# EAGLE design Amplificador_Push_Pull_AB (EAGLE 7.6.0)
CNAME: Amplificador Push-Pull; CREVISION: 1.0; DESIGNER: Pedro Nori
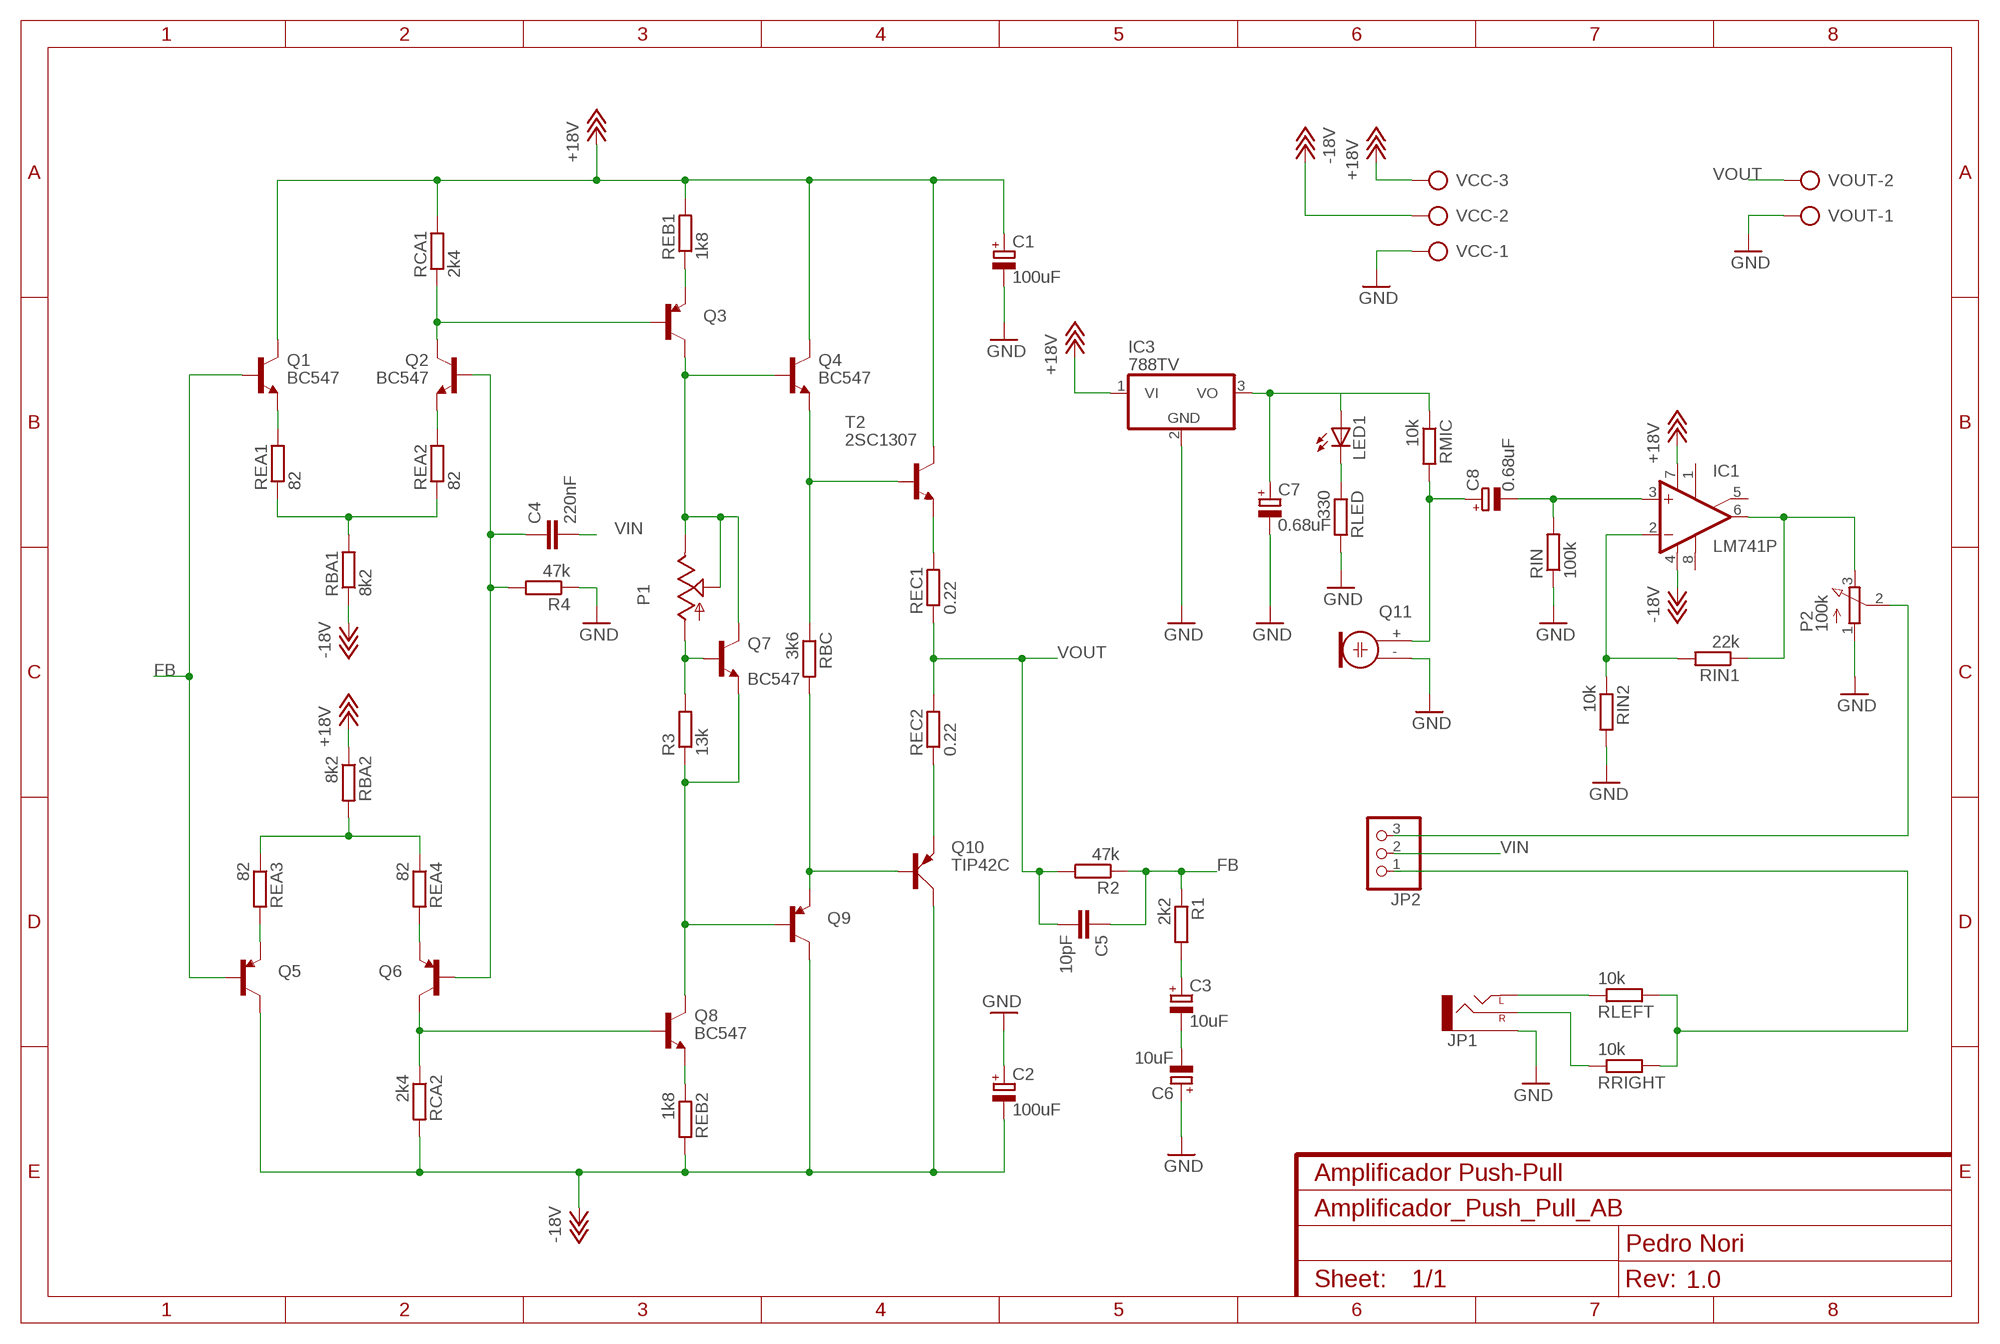
[diagram p0: schematic, sheet 1]
AUI_MAUE (FRAME-A4L): TESTE1: valordoteste1

## Parts
C1  100uF  CPOL-EUE2.5-6  [E2,5-6]
C2  100uF  CPOL-EUE2.5-6  [E2,5-6]
C3  10uF  CPOL-EUE2.5-5  [E2,5-5]
C4  220nF  C-EU025-025X050  [C025-025X050]
C5  10pF  C-EU025-025X050  [C025-025X050]
C6  10uF  CPOL-EUE2.5-5  [E2,5-5]
C7  0.68uF  CPOL-EUE2.5-5  [E2,5-5]
C8  0.68uF  CPOL-EUE2.5-5  [E2,5-5]
IC1  LM741P  [DIL08]
IC3  788TV  [TO220V]
JP1  AUDIO-JACKPTH  [AUDIO-JACK]
JP2  PINHD-1X3  [1X03]
LED1  LED5MM  [LED5MM]
P1  TRIM_US-S64W  [S64W]
P2  100k  3RP/1610N  [3RP/1610N]
Q1  BC547  [TO92]
Q2  BC547  [TO92]
Q3  TRANSISTOR_PNPTO92  [TO-92]
Q4  BC547  [TO92]
Q5  TRANSISTOR_PNPTO92  [TO-92]
Q6  TRANSISTOR_PNPTO92  [TO-92]
Q7  BC547  [TO92]
Q8  BC547  [TO92]
Q9  TRANSISTOR_PNPTO92  [TO-92]
Q10  TIP42C  [TO220AV]
Q11  ELECTRET  [9.7ELECTRET]
R1  2k2  R-EU_0207/10  [0207/10]
R2  47k  R-EU_0207/10  [0207/10]
R3  13k  R-EU_0207/10  [0207/10]
R4  47k  R-EU_0207/10  [0207/10]
RBA1  8k2  R-EU_0207/10  [0207/10]
RBA2  8k2  R-EU_0207/10  [0207/10]
RBC  3k6  R-EU_0207/10  [0207/10]
RCA1  2k4  R-EU_0207/10  [0207/10]
RCA2  2k4  R-EU_0207/10  [0207/10]
REA1  82  R-EU_0207/10  [0207/10]
REA2  82  R-EU_0207/10  [0207/10]
REA3  82  R-EU_0207/10  [0207/10]
REA4  82  R-EU_0207/10  [0207/10]
REB1  1k8  R-EU_0207/10  [0207/10]
REB2  1k8  R-EU_0207/10  [0207/10]
REC1  0.22  R-EU_0617/22  [0617/22]
REC2  0.22  R-EU_0617/22  [0617/22]
RIN  100k  R-EU_0207/7  [0207/7]
RIN1  22k  R-EU_0207/7  [0207/7]
RIN2  10k  R-EU_0207/10  [0207/10]
RLED  330  R-EU_0207/7  [0207/7]
RLEFT  10k  R-EU_0207/7  [0207/7]
RMIC  10k  R-EU_0207/7  [0207/7]
RRIGHT  10k  R-EU_0207/7  [0207/7]
T2  2SC1307  [TO220AV]
VCC  AK500/3-H  [AK500/3-H]
VOUT  AK500/2-H  [AK500/2-H]

## Nets
+5V: C7.+ IC3.3(VO) LED1.A RMIC.1
+18V: C1.+ IC1.7(V+) IC3.1(VI) Q1.3(C) Q4.3(C) RBA2.1 RCA1.2 REB1.2 T2.2(C) VCC.3
-18V: C2.- IC1.4(V-) Q5.1(C) Q9.1(C) Q10.C RBA1.1 RCA2.2 REB2.2 VCC.2
FB: C5.1 Q1.2(B) Q5.2(B) R1.1 R2.1
GND: C1.- C2.+ C6.+ C7.- IC3.2(GND) JP1.SLEEVE P2.1(A) Q11.- R4.1 RIN2.2 RIN.1 RLED.2 VCC.1 VOUT.1
HEHEAH: C4.1 Q2.2(B) Q6.2(B) R4.2
N$1: Q1.1(E) REA1.2
N$2: RBA1.2 REA1.1 REA2.1
N$3: RBA2.2 REA3.1 REA4.1
N$4: Q2.1(E) REA2.2
N$5: Q2.3(C) Q3.2(B) RCA1.1
N$6: Q6.3(E) REA4.2
N$7: Q5.3(E) REA3.2
N$8: Q6.1(C) Q8.2(B) RCA2.1
N$9: C8.+ Q11.+ RMIC.2
N$10: Q3.3(E) REB1.1
N$11: P1.E P1.S Q3.1(C) Q4.2(B) Q7.3(C)
N$12: JP1.RING(RIGHT) RRIGHT.1
N$13: Q4.1(E) RBC.1 T2.1(B)
N$14: JP1.TIP(LEFT) RLEFT.1
N$15: Q7.1(E) Q8.3(C) Q9.2(B) R3.1
N$16: Q8.1(E) REB2.1
N$17: Q9.3(E) Q10.B RBC.2
N$18: LED1.K(C) RLED.1
N$19: REC1.2 T2.3(E)
N$20: JP2.1 RLEFT.2 RRIGHT.2
N$21: Q10.E REC2.1
N$22: C3.- C6.-
N$23: C3.+ R1.2
N$25: C8.- IC1.3(+IN) RIN.2
N$26: IC1.2(-IN) RIN1.2 RIN2.1
N$27: IC1.6(OUT) P2.3(E) RIN1.1
N$30: JP2.3 P2.2(S)
P1: P1.A Q7.2(B) R3.2
VIN: C4.2 JP2.2
VOUT: C5.2 R2.2 REC1.1 REC2.2 VOUT.2
Unconnected: IC1.1(ON1) IC1.5(ON2) IC1.8(OPT)

## Library data of the parts
C1-C3 C6-C8 = rcl:CPOL-EU: POLARIZED CAPACITOR, European symbol
C4 C5 = rcl:C-EU: CAPACITOR, European symbol
IC1 = linear:*741: OP AMP
IC3 = linear:78*: Positive VOLTAGE REGULATOR Source: http://cache.national.com/ds/LM/LM78L05.pdf http://www.fairchildsemi.com/ds/LM/LM7805.pdf
JP1 = SparkFun-Connectors:AUDIO-JACK: 3.5mm Audio Jack Simple 3.5mm common PCB mount audio jack. SKU: PRT-08032
JP2 = pinhead:PINHD-1X3: PIN HEADER
LED1 = adafruit:LED: LED OSRAM: - CHIPLED LG R971, LG N971, LY N971, LG Q971, LY Q971, LO R971, LY R971 LH N974, LH R974 LS Q976, LO Q976, LY Q976 LO Q996 - Hyper CHIPLED LW Q18S LB Q993, LB Q99A, LB R99A - SideLED LS A670, LO A670, LY A670, LG A670, LP A670 LB A673, LV A673, LT A673, LW A673 LH A674 LY A675 LS A676, LA A676, LO A676, LY A676, LW A676 LS A679, LY A679, LG A679 - Hyper Micro SIDELED® LS Y876, LA Y876, LO Y876, LY Y876 LT Y87S - SmartLED LW L88C, LW L88S LB L89C, LB L89S, LG L890 LS L89K, LO L89K, LY L89K LS L896, LA L896, LO L896, LY L896 - TOPLED LS T670, LO T670, LY T670, LG T670, LP T670 LSG T670, LSP T670, LSY T670, LOP T670, LYG T670 LG T671, LOG T671, LSG T671 LB T673, LV T673, LT T673, LW T673 LH T674 LS T676, LA T676, LO T676, LY T676, LB T676, LH T676, LSB T676, LW T676 LB T67C, LV T67C, LT T67C, LS T67K, LO T67K, LY T67K, LW E67C LS E67B, LA E67B, LO E67B, LY E67B, LB E67C, LV E67C, LT E67C LW T67C LS T679, LY T679, LG T679 LS T770, LO T770, LY T770, LG T770, LP T770 LB T773, LV T773, LT T773, LW T773 LH T774 LS E675, LA E675, LY E675, LS T675 LS T776, LA T776, LO T776, LY T776, LB T776 LHGB T686 LT T68C, LB T68C - Hyper Mini TOPLED® LB M676 - Mini TOPLED Santana® LG M470 LS M47K, LO M47K, LY M47K Source: http://www.osram.convergy.de/
P1 = pot:TRIM_US-: POTENTIOMETER
P2 = pot:3RP/1610N: 16mm Potentiometer one level Source: http://www.alphapotentiometers.net/html/16mm_pot_2.html
Q1 Q2 Q4 Q7 Q8 = transistor:BC547: NPN TRANSISTOR
Q3 Q5 Q6 Q9 = SparkFun-DiscreteSemi:TRANSISTOR_PNP: Generic PNP BJT Double check pinouts against datasheets- not all devices are the same! MMBT3906 - 40V 200mA SOT-23 (TRANS-08052) MMBT4403 - 40V 600mA SOT-23 (TRANS-09245)
Q10 = transistor-power:TIP42C: PNP TRANSISTOR
Q11 = adafruit:ELECTRET: Electret microphone Thru hole 2.54mm spacing with 9.7mm diameter
R1-R4 RBA1 RBA2 RBC RCA1 RCA2 REA1-REA4 REB1 REB2 REC1 REC2 RIN RIN1 RIN2 RLED RLEFT RMIC RRIGHT = rcl:R-EU_: RESISTOR, European symbol
T2 = transistor-neu-to92:2SC1307: NPN Transistor Silicon Epitaxial, High Frequency Power Amplifier Source: 2SC1307.pdf
VCC = con-ptr500:AK500/3-H: CONNECTOR Aug. 2004 / PTR Meßtechnik: Die Bezeichnung der Serie AK505 wurde geändert. Es handelt sich hierbei um AK500 in horizontaler Ausführung.; OC_FARNELL: unknown; OC_NEWARK: unknown
VOUT = con-ptr500:AK500/2-H: CONNECTOR Aug. 2004 / PTR Meßtechnik: Die Bezeichnung der Serie AK505 wurde geändert. Es handelt sich hierbei um AK500 in horizontaler Ausführung.; OC_FARNELL: unknown; OC_NEWARK: unknown

## Board
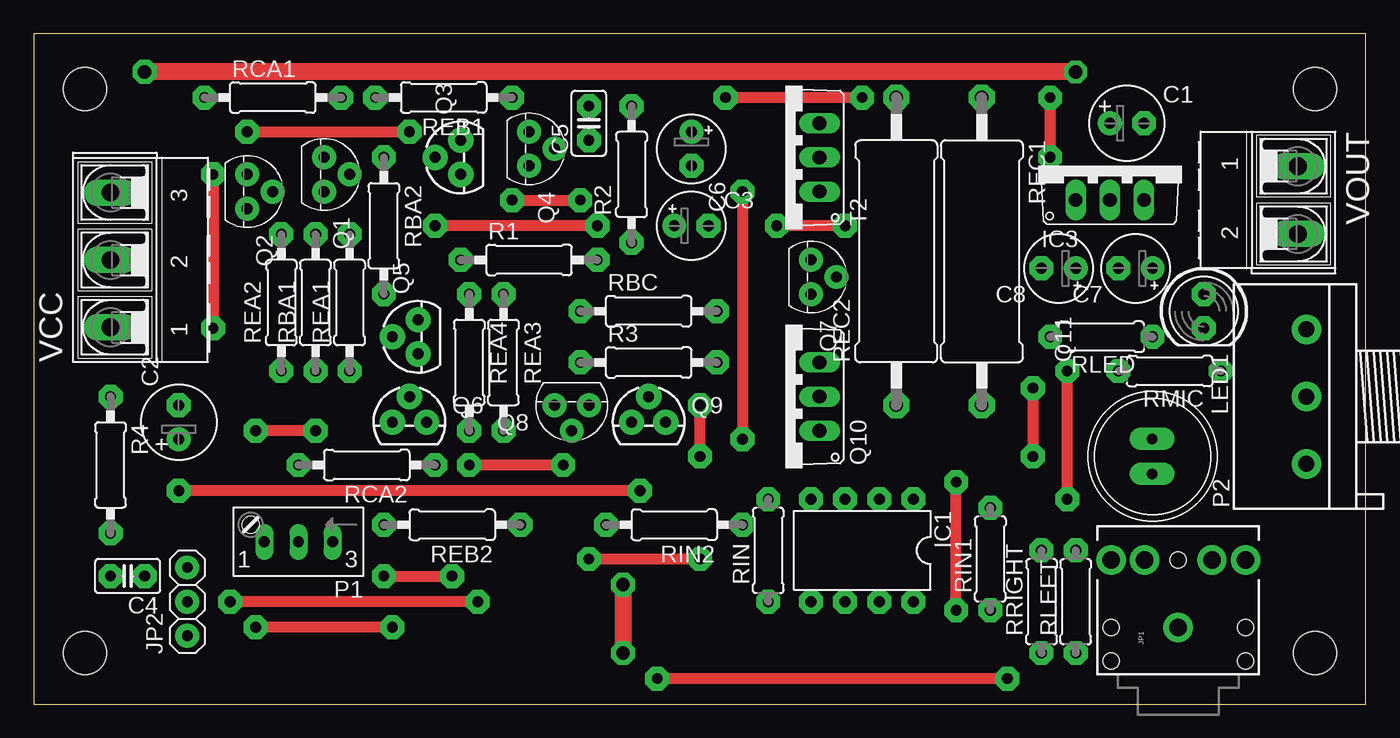
[diagram p1: board, top side]
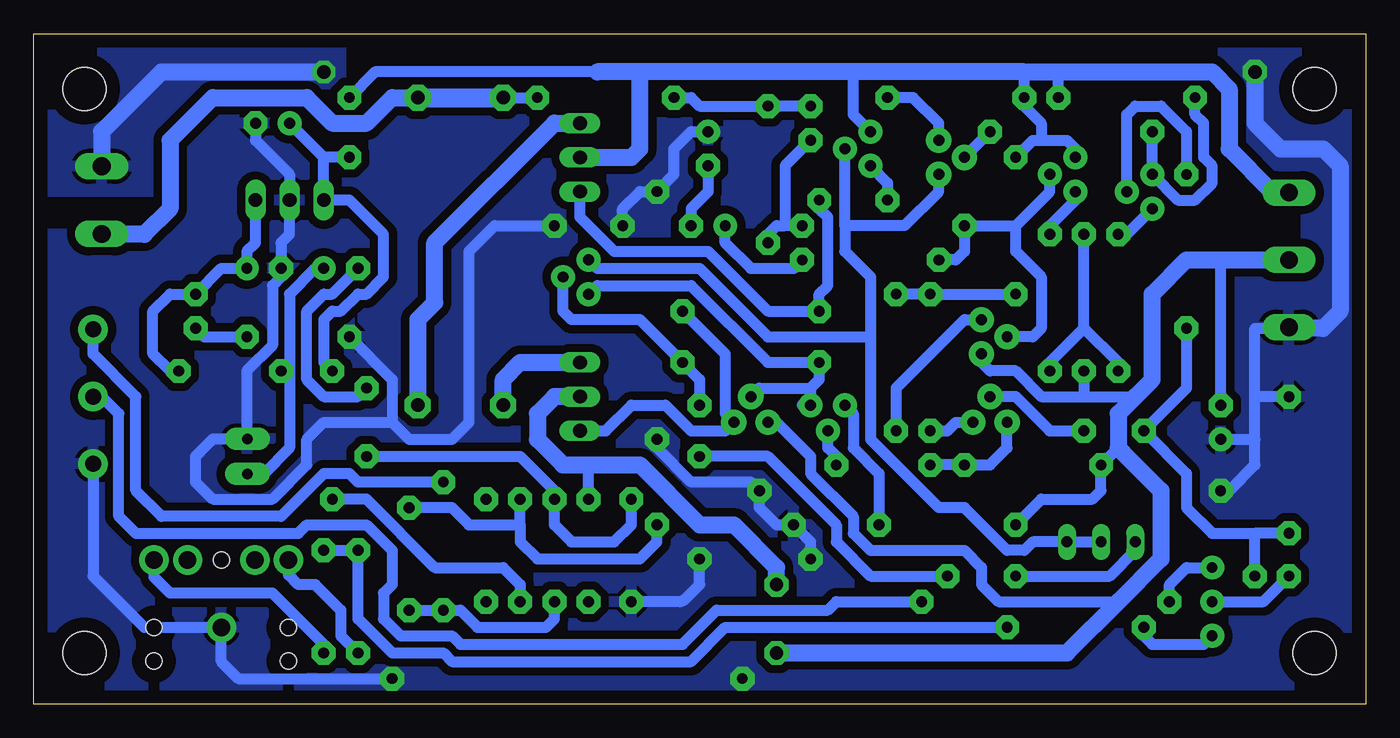
[diagram p2: board, bottom side, seen from below]

Size 99.04 x 49.84 mm. Coordinates in mm from the lower left corner, seen from the top.
Outline: 0,0 99.04,0 99.04,49.84 0,49.84 0,0
Copper layers (1*16): Top 0.035mm / dielectric 1.5mm / Bottom 0.035mm
Design rules "default *": minimum track width 10mil, minimum drill 24mil, track to track 8mil, track to pad 8mil, pad to pad 8mil, via to via 8mil, smd to smd 8mil, copper to edge 40mil, drill to drill 8mil, minimum pad ring 10mil, minimum via ring 8mil, stop-mask expansion 4mil, vias tented up to drill 0mil, thermal gap 12mil
Holes 3.2 mm at 3.81,3.81 3.81,45.72 95.25,45.72 95.25,3.81

### Footprints (pad centres in the part's own frame; a part is rotated, then mirrored left to right if it is on the bottom)
E2,5-6 = drill 0.813 pad 1.778: + -1.27,0 | drill 0.813 pad 1.778 octagon: - 1.27,0
E2,5-5 = drill 0.813 pad 1.778: + -1.27,0 | drill 0.813 pad 1.778 octagon: - 1.27,0
C025-025X050 = drill 0.8 pad 1.778 octagon: 1 -1.27,0; 2 1.27,0
DIL08 = drill 0.813 pad 1.778 octagon: 1 -3.81,-3.81; 2 -1.27,-3.81; 3 1.27,-3.81; 4 3.81,-3.81; 5 3.81,3.81; 6 1.27,3.81; 7 -1.27,3.81; 8 -3.81,3.81
TO220V = drill 1.016 long: 1 -2.54,-2.54; 2 0,-2.54; 3 2.54,-2.54
AUDIO-JACK = drill 1.3 pad 2.184: RING 5,5; RSH 5,2.5; SLEEVE 0,0; TIP 5,-5; TSH 5,-2.5 | hole 1.2: 0,5; -2.5,5; -2.5,-5; 0,-5; 5,0
1X03 = drill 0.8 pad 1.778: 1 -2.54,0; 2 0,0; 3 2.54,0
LED5MM = drill 0.813 pad 1.778 octagon: A -1.27,0; K 1.27,0
S64W = drill 0.813 long: A 2.54,1.27; E -2.54,1.27; S 0,1.27
3RP/1610N = drill 1.2 pad 2.184: 1 -5,0; 2 0,0; 3 5,0
TO92 = drill 0.813 pad 1.778: 1 1.27,0; 2 0,1.905; 3 -1.27,0
TO-92 = drill 0.813 pad 1.88: 1 -1.27,0; 2 0,1.905; 3 1.27,0
TO220AV = drill 1.016 long: B -2.54,-2.54; C 0,-2.54; E 2.54,-2.54
9.7ELECTRET = drill 0.8 pad 1.676 long: + 1.3,-0.032; - -1.3,-0.032
0207/10 = drill 0.8 pad 1.778 octagon: 1 -5.08,0; 2 5.08,0
0617/22 = drill 1 pad 1.93 octagon: 1 -11.43,0; 2 11.43,0
0207/7 = drill 0.813 pad 1.778 octagon: 1 -3.81,0; 2 3.81,0
TO220AV' = drill 1.016 long: 1 -2.54,-2.54; 2 0,-2.54; 3 2.54,-2.54
AK500/3-H = drill 1.321 long: 1 -5.004,0; 2 0,0; 3 5.004,0
AK500/2-H = drill 1.321 long: 1 -2.515,0; 2 2.515,0

### Placement (x,y rotation side)
C1  81.28,43.18 0 top
C2  10.79,20.95 90 top
C3  48.9,35.56 0 top
C4  6.99,9.53 180 top
C5  41.27,43.18 90 top
C6  48.9,41.27 270 top
C7  81.92,32.38 180 top
C8  76.2,32.38 180 top
IC1  61.59,11.43 180 top
IC3  80.01,40.01 0 top
JP1  85.09,5.71 90 top
JP2  11.43,7.62 90 top
LED1  87,29.21 270 top
P1  19.68,13.34 180 top
P2  94.61,22.86 90 top
Q1  21.59,39.37 270 top
Q2  15.88,38.1 270 top
Q3  31.75,40.64 90 top
Q4  36.83,41.27 270 top
Q5  28.57,27.3 90 top
Q6  27.94,20.95 0 top
Q7  57.78,31.75 270 top
Q8  40.01,22.23 180 top
Q9  45.72,20.95 0 top
Q10  55.88,22.86 90 top
Q11  83.19,18.41 270 top
R1  36.83,33.02 0 top
R2  44.45,39.37 90 top
R3  45.72,25.4 0 top
R4  5.71,17.78 270 top
RBA1  20.95,29.84 90 top
RBA2  26.04,35.56 270 top
RBC  45.72,29.21 0 top
RCA1  17.78,45.09 0 top
RCA2  24.77,17.78 180 top
REA1  23.5,29.84 90 top
REA2  18.41,29.84 90 top
REA3  34.92,25.4 270 top
REA4  32.38,25.4 270 top
REB1  30.48,45.09 180 top
REB2  31.11,13.34 180 top
REC1  70.48,33.66 270 top
REC2  64.14,33.66 90 top
RIN  54.61,11.43 90 top
RIN1  71.12,10.79 90 top
RIN2  47.62,13.34 180 top
RLED  79.38,27.3 180 top
RLEFT  77.47,7.62 90 top
RMIC  84.45,24.77 180 top
RRIGHT  74.93,7.62 90 top
T2  2SC1307  [TO220AV']  55.88,40.64 90 top
VCC  5.71,33.02 90 top
VOUT  93.98,37.47 270 top

### Tracks (layer width: path | path; a pad name or v marks a point on that pad's centre or on a via)
+5V
  Bottom 0.813: IC3.3 82.55,34.29 83.19,33.66 C7.+ 85.09,32.38 LED1.A 88.9,30.48 90.17,29.21 90.17,26.04 88.9,24.77 RMIC.1
+18V  (via drill 0.8 pad 1.78)
  Top 0.813: v75.56,45.09 v75.56,40.64 | v76.83,15.24 v76.83,24.77
  Bottom 0.813: 24.13,41.91 24.77,41.91 RBA2.1 | 24.13,41.91 22.23,41.91 21.59,41.27 Q1.3 | 25.4,46.99 REB1.2 25.4,44.45 24.13,43.18 24.13,41.91 | Q4.3 38.1,43.81 38.1,46.99 | 57.15,46.99 73.66,46.99 v75.56,45.09 | RCA1.2 22.86,46.99 | v76.83,24.77 77.47,25.4 77.47,28.57 76.83,29.21 76.2,29.21 74.93,30.48 74.3,30.48 73.03,31.75 73.03,34.92 75.56,37.47 IC3.1 77.47,40.64 | IC1.7 62.87,8.89 64.14,10.16 69.22,10.16 74.3,15.24 v76.83,15.24 | v75.56,40.64 77.47,40.64 | 77.47,40.64 C1.+
  Bottom 1.27: 53.98,46.99 38.1,46.99 25.4,46.99 22.86,46.99 11.43,46.99 10.16,45.72 10.16,41.27 6.99,38.1 5.79,38.1 VCC.3 | 53.98,46.99 57.15,46.99 | T2.2 54.61,40.64 53.98,41.27 53.98,46.99
-18V  (via drill 1 pad 1.78)
  Top 1.27: v43.81,8.89 v43.81,3.81
  Bottom 0.813: RBA1.1 20.95,22.86 | 20.95,22.86 24.13,22.86 26.04,24.77 27.94,24.77 28.57,25.4 Q5.1 | 20.95,22.86 17.14,22.86 | Q9.1 43.81,20.95 41.27,18.41 41.27,17.14 38.1,13.97 38.1,12.7 36.83,11.43 29.84,11.43 28.57,10.16 28.57,8.89 27.3,7.62 18.41,7.62 | 18.1,18.73 18.73,18.73 RCA2.2 19.68,15.88 20.32,15.24 24.13,15.24 REB2.2 | IC1.4 57.78,17.78 | C2.- 10.79,33.02
  Bottom 1.27: Q10.C 60.33,22.86 61.59,21.59 61.59,19.68 59.69,17.78 57.78,17.78 53.98,17.78 49.53,13.34 46.99,13.34 43.81,10.16 v43.81,8.89 | VCC.2 10.79,33.02 13.34,33.02 15.88,30.48 15.88,24.13 17.14,22.86 18.41,21.59 18.41,19.05 18.1,18.73 15.24,15.88 15.24,10.79 18.41,7.62 22.23,3.81 v43.81,3.81
FB  (via drill 0.8 pad 1.78)
  Top 0.813: v41.91,35.56 v29.84,35.56
  Bottom 0.813: 26.04,35.56 v29.84,35.56 29.84,33.66 30.48,33.02 R1.1 | 26.04,35.56 23.5,38.1 Q1.2 | 26.04,35.56 26.04,33.66 24.13,31.75 24.13,27.94 24.77,27.3 Q5.2 | v41.91,35.56 43.18,35.56 | C5.1 43.18,40.01 43.18,35.56 | R2.1 44.45,34.92 43.81,35.56 43.18,35.56
GND  (via drill 0.8 pad 1.78, 1 pad 1.68, 1 pad 1.78)
  Top 0.813: v41.27,10.79 v49.53,10.79 | v60.33,35.56 v55.24,35.56 | v52.7,38.1 v52.7,19.68 | v45.09,15.88 v10.79,15.88 | v72.39,1.91 v46.35,1.91
  Top 1.27: v77.47,46.99 v8.26,46.99
  Bottom 0.813: R4.1 8.26,22.86 | C6.+ 50.16,42.55 51.44,41.27 51.44,39.37 v52.7,38.1 53.98,38.1 55.24,36.83 v55.24,35.56 | v60.33,35.56 64.77,35.56 66.67,33.66 66.67,20.95 67.94,19.68 71.12,19.68 72.39,20.95 | v52.7,19.68 52.7,19.05 50.16,16.51 45.72,16.51 v45.09,15.88 45.09,14.61 43.81,13.34 RIN2.2 41.27,12.06 v41.27,10.79 | 5.16,27.94 6.99,27.94 | v10.79,15.88 10.16,15.88 8.26,17.78 8.26,19.68 | Q11.- 83.18,19.68 83.19,19.68 83.19,19.75 | 94,40.01 VOUT.1 | RLED.2 72.39,24.13 72.39,20.95 | C1.- 82.55,41.91 80.01,39.37 IC3.2 80.01,34.92 80.64,34.29 C7.- 80.64,31.75 81.28,31.11 81.28,26.67 83.19,24.77 83.19,19.75 | 83.19,19.75 Q11.- | 72.39,20.95 77.47,20.95 78.74,19.68 78.74,17.78 81.28,15.24 85.72,15.24 87,16.51 87,18.41 85.69,19.71 Q11.- | 8.26,19.68 8.26,22.86 | 8.26,22.86 8.26,27.94 5.9,27.94 arc-45 VCC.1 | RIN.1 51.06,7.62 arc-45 50.61,7.81 49.53,8.89 v49.53,10.79 | P2.1 94.69,17.86 | 94.81,17.78 arc-45 P2.1 | P2.1 94.61,9.53 90.81,5.71 JP1.SLEEVE 85.09,3.17 83.82,1.91 v72.39,1.91 | C2.+ 8.26,19.68
  Bottom 1.27: 4.52,27.94 5.08,27.98 | 5.08,27.98 5.12,27.98 | 5.12,27.98 VCC.1 | 5.16,27.94 5.12,27.98 | v77.47,46.99 89.53,46.99 93.98,42.55 VOUT.1 | v8.26,46.99 8.26,43.18 6.35,41.27 3.17,41.27 1.91,40.01 1.91,29.21 3.17,27.94 5.04,27.94 5.08,27.98
  pour Bottom (isolate 0.61): 88.9,38.1 99.06,38.1 99.06,49.53 76.2,49.53 76.2,45.09 85.72,45.09 88.9,41.91
  pour Bottom (isolate 0.61): 11.43,49.53 0,49.53 0,27.94 10.79,27.94 10.79,33.02 4.45,33.02 4.45,38.1 6.99,38.1 10.16,41.27 10.16,45.72 11.43,46.99
  pour Bottom (isolate 0.61): 0,27.94 10.79,27.94 10.79,33.02 5.71,33.02 4.45,33.02 4.45,38.1 6.99,38.1 10.16,41.27 10.16,45.72 12.7,48.26 72.39,48.26 75.56,45.09 85.72,45.09 88.9,41.91 88.9,36.83 90.81,34.92 99.06,34.92 99.06,0 0,0
HEHEAH  (via drill 0.8 pad 1.78)
  Top 0.813: v20.95,20.32 v16.51,20.32 | v13.34,39.37 v13.34,27.94
  Bottom 0.813: Q6.2 26.04,22.86 23.5,20.32 v20.95,20.32 | v13.34,27.94 13.34,23.5 v16.51,20.32 13.34,17.14 13.34,14.61 11.43,12.7 8.26,12.7 | C4.1 8.26,12.7 | Q2.2 17.78,43.81 17.14,44.45 15.24,44.45 13.34,42.55 v13.34,39.37 | R4.2 8.26,12.7
N$1
  Bottom 0.813: REA1.2 23.5,35.56 21.59,37.47 Q1.1
N$2
  Bottom 0.813: REA2.1 18.41,25.4 20.95,27.94 | REA1.1 23.5,25.4 20.95,27.94 | 20.95,27.94 RBA1.2
N$3
  Bottom 0.813: REA3.1 REA4.1 RBA2.2
N$4
  Bottom 0.813: REA2.2 17.78,34.92 Q2.1
N$5  (via drill 0.8 pad 1.78)
  Top 0.813: v15.88,42.55 v27.94,42.55
  Bottom 0.813: v27.94,42.55 Q3.2 | v15.88,42.55 Q2.3 13.97,37.47 12.7,37.47 11.43,38.73 11.43,40.01 12.06,40.64 12.06,43.18 12.7,43.81 RCA1.1
N$6
  Bottom 0.813: REA4.2 31.11,20.32 30.48,20.95 Q6.3
N$7
  Bottom 0.813: REA3.2 34.92,23.5 29.84,28.57 Q5.3
N$8  (via drill 0.8 pad 1.78)
  Top 0.813: v32.38,17.78 v39.37,17.78
  Bottom 0.813: Q6.1 26.67,19.05 27.94,17.78 RCA2.1 v32.38,17.78 | Q8.2 40.01,19.05 39.37,18.41 v39.37,17.78
N$9
  Bottom 0.813: Q11.+ 83.12,17.14 81.92,17.14 80.01,19.05 80.01,24.77 | 80.01,24.77 80.01,30.48 78.11,32.38 C8.+ | RMIC.2 80.01,24.77
N$10
  Bottom 0.813: REB1.1 33.66,45.09 31.75,43.18 Q3.3
N$11
  Bottom 0.813: Q3.1 31.75,38.1 34.29,35.56 38.73,35.56 | P1.S P1.E 24.77,12.06 25.4,11.43 26.67,11.43 29.84,14.61 31.75,14.61 36.83,19.68 36.83,27.3 | 38.73,35.56 Q4.2 | 38.73,35.56 38.73,33.66 36.83,31.75 36.83,27.3 | Q7.3 57.15,32.38 49.53,32.38 44.45,27.3 36.83,27.3
N$12
  Bottom 0.813: JP1.RING 80.09,9.61 79.38,8.89 78.11,8.89 76.2,6.99 76.2,5.08 RRIGHT.1
N$13  (via drill 0.8 pad 1.78)
  Top 0.813: v35.56,37.47 v40.64,37.47
  Bottom 0.813: Q4.1 35.56,38.73 v35.56,37.47 | T2.1 58.42,36.2 55.88,33.66 48.9,33.66 44.45,29.21 RBC.1 40.64,30.48 40.01,31.11 40.01,36.2 40.64,36.83 v40.64,37.47
N$14
  Bottom 0.813: JP1.TIP 90.09,9.45 88.9,8.26 81.28,8.26 77.47,4.45 RLEFT.1
N$15
  Bottom 0.813: Q7.1 57.15,31.11 50.16,31.11 44.45,25.4 R3.1 40.64,24.13 41.27,23.5 | 41.27,23.5 Q8.3 41.91,22.23 | Q9.2 45.09,23.5 41.27,23.5
N$16
  Bottom 0.813: Q8.1 38.1,21.59 38.1,19.05 36.2,17.14 REB2.1
N$17
  Bottom 0.813: Q10.B 56.52,20.32 54.61,22.23 52.07,22.23 50.16,20.32 47.62,20.32 Q9.3 47.62,21.59 47.62,26.04 RBC.2
N$18
  Bottom 0.813: LED1.K 86.36,27.3 RLED.1
N$19
  Bottom 1.27: REC1.2 70.48,28.57 69.22,29.84 69.22,34.29 60.33,43.18 T2.3
N$20  (via drill 0.8 pad 1.78)
  Top 0.813: v26.67,5.71 v16.51,5.71
  Bottom 0.813: JP2.1 12.06,4.45 15.88,4.45 16.51,5.08 v16.51,5.71 | RLEFT.2 RRIGHT.2 74.93,6.35 72.39,3.81 68.58,3.81 67.94,3.17 50.16,3.17 47.62,5.71 v26.67,5.71
N$21
  Bottom 1.27: REC2.1 64.14,24.13 62.87,25.4 Q10.E
N$22
  Bottom 0.813: C6.- 48.9,38.1 50.16,36.83 C3.-
N$23
  Bottom 0.813: C3.+ 47.62,34.29 45.72,32.38 42.55,32.38 R1.2
N$25  (via drill 0.8 pad 1.78)
  Top 0.813: v74.3,23.5 v74.3,18.41
  Bottom 0.813: v74.3,23.5 74.93,22.86 77.47,22.86 78.74,24.13 78.74,29.21 77.47,30.48 76.83,30.48 C8.- | v74.3,18.41 62.87,18.41 60.33,15.88 IC1.3 60.33,13.34 59.05,12.06 55.88,12.06 54.61,13.34 RIN.2
N$26
  Bottom 0.813: RIN2.1 52.7,12.06 53.98,10.79 61.59,10.79 62.87,12.06 62.87,13.34 | 62.87,13.34 66.67,13.34 67.94,14.61 RIN1.2 | 62.87,13.34 IC1.2
N$27  (via drill 0.8 pad 1.78)
  Top 0.813: v68.58,6.99 v68.58,16.51
  Bottom 0.813: P2.3 94.61,26.04 91.44,22.86 91.44,15.88 89.53,13.97 80.64,13.97 77.47,17.14 75.56,17.14 74.93,16.51 v68.58,16.51 | IC1.6 60.33,6.35 60.96,5.71 66.04,5.71 67.31,6.99 v68.58,6.99 RIN1.1
N$30  (via drill 0.8 pad 1.78)
  Top 0.813: v33.02,7.62 v14.61,7.62
  Bottom 0.813: JP2.3 13.34,10.16 14.61,8.89 v14.61,7.62 | P2.2 93.98,22.86 92.71,21.59 92.71,13.97 91.44,12.7 79.38,12.7 78.74,13.34 74.3,13.34 72.39,11.43 72.39,8.89 73.03,8.26 73.03,6.35 71.75,5.08 67.94,5.08 67.31,4.45 50.8,4.45 48.26,6.99 40.01,6.99 39.37,7.62 v33.02,7.62
P1  (via drill 0.8 pad 1.78)
  Top 0.813: v49.53,18.41 v49.53,22.23 | v26.04,9.53 v31.11,9.53
  Bottom 0.813: Q7.2 59.69,29.21 59.05,28.57 53.98,28.57 R3.2 49.53,24.13 v49.53,22.23 | P1.A 17.14,11.43 19.05,9.53 v26.04,9.53 | v49.53,18.41 44.45,18.41 39.37,13.34 39.37,12.06 36.83,9.53 v31.11,9.53
VIN
  Bottom 0.813: JP2.2 7.62,7.62 C4.2
VOUT  (via drill 0.8 pad 1.78)
  Top 0.813: v61.59,45.09 v51.44,45.09
  Bottom 0.813: REC2.2 v61.59,45.09 | v51.44,45.09 50.16,45.09 49.53,44.45 R2.2 C5.2
  Bottom 1.27: REC1.1 72.39,45.09 74.3,43.18 76.83,43.18 78.74,45.09 85.72,45.09 88.9,41.91 88.9,36.83 90.81,34.92 93.95,34.92 VOUT.2
  Bottom 1.422: REC1.1 REC2.2